# Altium project SS2_initial.PrjPcb
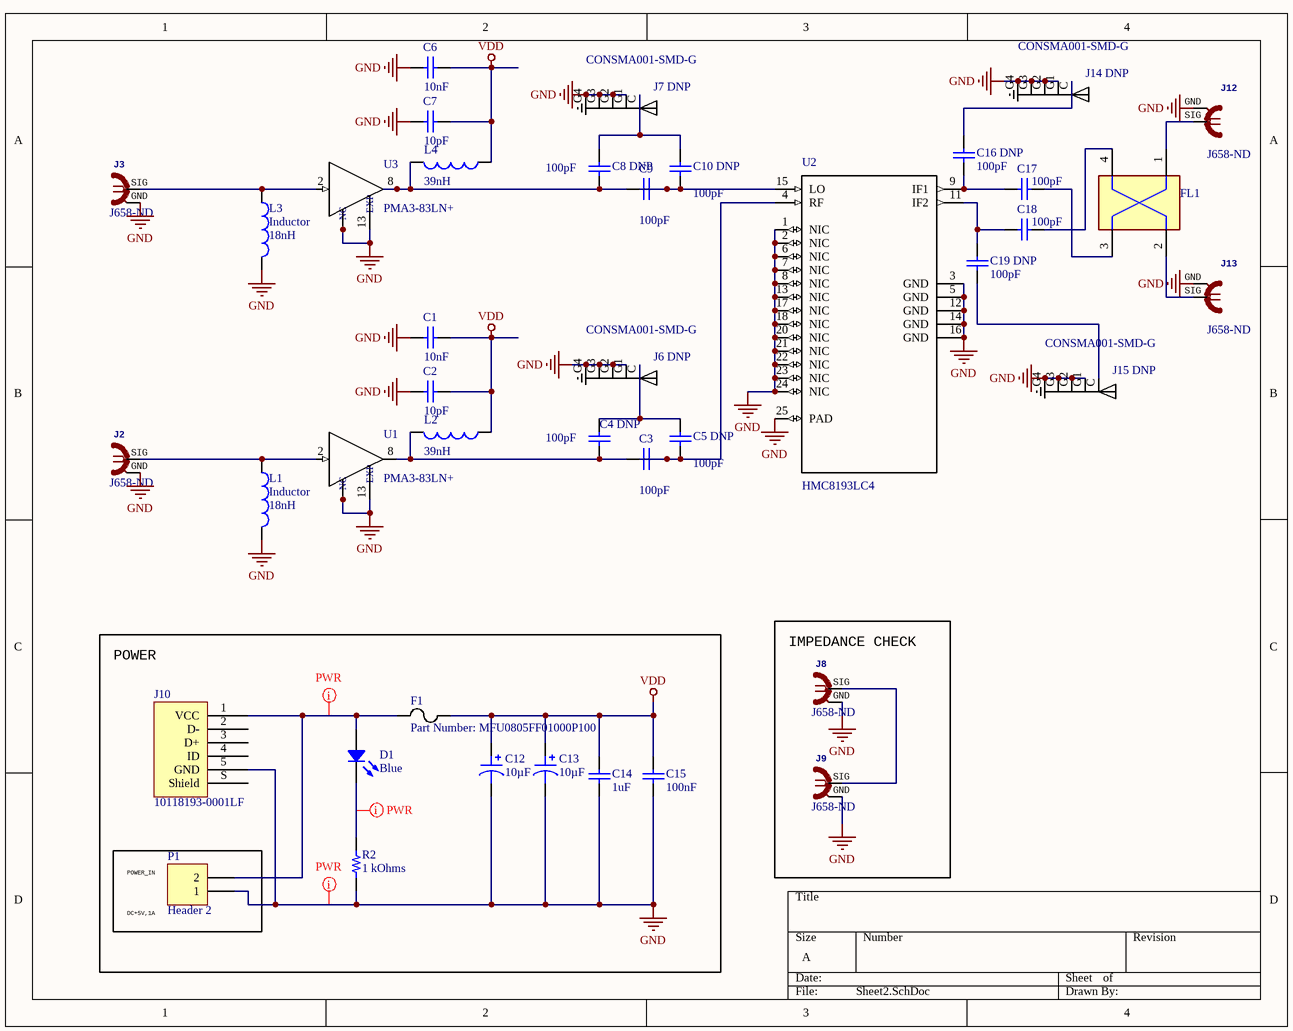
[diagram p0: Sheet2.SchDoc]
1 sheet, 41 parts. Net scope: global (net labels, ports and power ports of the same name join across sheets).
Board file: PCB2.PcbDoc

## Sheet Sheet2.SchDoc
size A

### Parts
C1  value 10nF  [1608[0603]]  (hidden comment: Cap Semi)
C2  value 10pF  [1608[0603]]  (hidden comment: Cap Semi)
C3  value 100pF  [1608[0603]]  (hidden comment: Cap Semi)
C4_DNP  value 100pF  [1608[0603]]  (hidden comment: Cap Semi)
C5_DNP  value 100pF  [1608[0603]]  (hidden comment: Cap Semi)
C6  value 10nF  [1608[0603]]  (hidden comment: Cap Semi)
C7  value 10pF  [1608[0603]]  (hidden comment: Cap Semi)
C8_DNP  value 100pF  [1608[0603]]  (hidden comment: Cap Semi)
C9  value 100pF  [1608[0603]]  (hidden comment: Cap Semi)
C10_DNP  value 100pF  [1608[0603]]  (hidden comment: Cap Semi)
C12  10µF  [CAP POL 1411_3528]
C13  10µF  [CAP POL 1411_3528]
C14  value 1uF  [1608[0603]]  (hidden comment: Cap Semi)
C15  value 100nF  [1608[0603]]  (hidden comment: Cap Semi)
C16_DNP  value 100pF  [1608[0603]]  (hidden comment: Cap Semi)
C17  value 100pF  [1608[0603]]  (hidden comment: Cap Semi)
C18  value 100pF  [1608[0603]]  (hidden comment: Cap Semi)
C19_DNP  value 100pF  [1608[0603]]  (hidden comment: Cap Semi)
D1  Blue  [LED 0603_1608 BLUE]
F1  Part Number: MFU0805FF01000P100  [FUS_VISHAY_MFU08]
FL1  11305-3S  [Anaren_11305-3S_MFG]  (value not drawn)
J2  Supplier Part Number 1: J658-ND  [SMA-OSHPARK-4L-1.6MM- ALT3]  (hidden comment: SMA 50 Ohm edge)
J3  Supplier Part Number 1: J658-ND  [SMA-OSHPARK-4L-1.6MM- ALT3]  (hidden comment: SMA 50 Ohm edge)
J6_DNP  CONSMA001-SMD-G  [*LINX_CONSMA001-SMD-G_CONSMA001-SMD-G(Primary)]
J7_DNP  CONSMA001-SMD-G  [*LINX_CONSMA001-SMD-G_CONSMA001-SMD-G(Primary)]
J8  Supplier Part Number 1: J658-ND  [SMA-OSHPARK-4L-1.6MM- ALT3]  (hidden comment: SMA 50 Ohm edge)
J9  Supplier Part Number 1: J658-ND  [SMA-OSHPARK-4L-1.6MM- ALT3]  (hidden comment: SMA 50 Ohm edge)
J10  10118193-0001LF  [FCI USB 10118193-0001LF]
J12  Supplier Part Number 1: J658-ND  [SMA-OSHPARK-4L-1.6MM- ALT3]  (hidden comment: SMA 50 Ohm edge)
J13  Supplier Part Number 1: J658-ND  [SMA-OSHPARK-4L-1.6MM- ALT3]  (hidden comment: SMA 50 Ohm edge)
J14_DNP  CONSMA001-SMD-G  [*LINX_CONSMA001-SMD-G_CONSMA001-SMD-G(Primary)]
J15_DNP  CONSMA001-SMD-G  [*LINX_CONSMA001-SMD-G_CONSMA001-SMD-G(Primary)]
L1  Inductor  value 18nH  [0603]
L2  value 39nH  [0603]  (hidden comment: Inductor)
L3  Inductor  value 18nH  [0603]
L4  value 39nH  [0603]  (hidden comment: Inductor)
P1  Header 2  [HDR1X2]
R2  1 kOhms  [RES 0603_1608]
U1  PMA3-83LN+  [*QFN51P300X300X89-13N]
U2  HMC8193LC4  [*PQFN50P390X390X100-25N]
U3  PMA3-83LN+  [*QFN51P300X300X89-13N]

### Blocks framed on the sheet
IMPEDANCE CHECK: J8 J9
POWER: C12-C15 D1 F1 J10 P1 R2

### Nets
GND: C1.2 C2.2 C6.2 C7.2 C12.2 C13.2 C14.2 C15.2 J2.GND J3.GND J6_DNP.G1(GND) J6_DNP.G2(GND) J6_DNP.G3(GND) J6_DNP.G4(GND) J7_DNP.G1(GND) J7_DNP.G2(GND) J7_DNP.G3(GND) J7_DNP.G4(GND) J8.GND J9.GND J10.5(GND) J12.GND J13.GND J14_DNP.G1(GND) J14_DNP.G2(GND) J14_DNP.G3(GND) J14_DNP.G4(GND) J15_DNP.G1(GND) J15_DNP.G2(GND) J15_DNP.G3(GND) J15_DNP.G4(GND) L1.2 L3.2 P1.1 R2.1 U1.1(NC) U1.3(NC) U1.4(NC) U1.5(NC) U1.6(NC) U1.7(NC) U1.9(NC) U1.10(NC) U1.13(EXP) U2.1(NIC) U2.2(NIC) U2.3(GND) U2.5(GND) U2.6(NIC) U2.7(NIC) U2.8(NIC) U2.12(GND) U2.13(NIC) U2.14(GND) U2.16(GND) U2.17(NIC) U2.18(NIC) U2.20(NIC) U2.21(NIC) U2.22(NIC) U2.23(NIC) U2.24(NIC) U2.25(PAD) U3.1(NC) U3.3(NC) U3.4(NC) U3.5(NC) U3.6(NC) U3.7(NC) U3.9(NC) U3.10(NC) U3.13(EXP)
VDD: C1.1 C2.1 C6.1 C7.1 C12.1 C13.1 C14.1 C15.1 F1.2 L2.1 L4.1
NetC3_1: C3.1 C4_DNP.2 L2.2 U1.8(RF-OUT_&_DC-IN)
NetC3_2: C3.2 C5_DNP.2 U2.4(RF)
NetC4_DNP_1: C4_DNP.1 C5_DNP.1 J6_DNP.C(FEEDING)
NetC8_DNP_1: C8_DNP.1 C10_DNP.1 J7_DNP.C(FEEDING)
NetC8_DNP_2: C8_DNP.2 C9.1 L4.2 U3.8(RF-OUT_&_DC-IN)
NetC9_2: C9.2 C10_DNP.2 U2.15(LO)
NetC16_DNP_1: C16_DNP.1 C17.2 U2.9(IF1)
NetC16_DNP_2: C16_DNP.2 J14_DNP.C(FEEDING)
NetC17_1: C17.1 FL1.3
NetC18_1: C18.1 FL1.4
NetC18_2: C18.2 C19_DNP.2 U2.11(IF2)
NetC19_DNP_1: C19_DNP.1 J15_DNP.C(FEEDING)
NetD1_1: D1.1 F1.1 J10.1(VCC) P1.2
NetD1_2: D1.2 R2.2
NetFL1_1: FL1.1 J12.SIG
NetFL1_2: FL1.2 J13.SIG
NetJ2_SIG: J2.SIG L1.1 U1.2(RF-IN)
NetJ3_SIG: J3.SIG L3.1 U3.2(RF-IN)
NetJ8_SIG: J8.SIG J9.SIG

Not connected (* = marked no-connect by the designer): J10 2(D-) 3(D+) 4(ID) S(Shield)

### Layout directives
rule Width Constraint [Pref Width = 10mil    Min Width = 10mil    Max Width = 10mil]: GND, NetD1_1, NetD1_2

### Notes on the sheet
- POWER_IN
- DC+5V,1A

### Library data of the parts
C1-C3 C4_DNP C5_DNP C6 C7 C8_DNP C9 C10_DNP C14 C15 C16_DNP C17 C18 C19_DNP = Cap Semi: Capacitor (Semiconductor SIM Model); Published: 8-Jun-2000; LatestRevisionDate: 29-May-2009; LatestRevisionNote: IPC-7351 Footprint Added.; PackageReference: C1206; Publisher: Altium Limited; PackageDescription: Chip Capacitor
C12 C13 = T491T106K016AT: CAP TANT 10UF 10% 16V 1411; Manufacturer: KEMET; Manufacturer Size Code: T; ESR (Equivalent Series Resistance): 8Ohm; Lifetime @ Temp.: 2000 Hrs @ 125°C; Type: Molded; Part Number: T491T106K016AT; Value: 10µF; Capacitance: 10µF; ComponentLink1Description: Datasheet; ComponentLink1URL: https://api.kemet.com/component-edge/download/datasheet/T491T106K016AT.pdf; ComponentLink2Description: DigiKey Link; ComponentLink2URL: http://digikey.com/product-detail/en/kemet/T491T106K016AT/399-8400-1-ND/3472123; Device Package: 1411 (3528 Metric); Features: General Purpose; Height - Seated (Max): 0.047" (1.20mm); LastUpdated: 1/2/2020 12:10:45 AM; Lifecycle Status: Active; Minimum Order: 1; Mounting Type: Surface Mount; Operating Temperature: -55°C ~ 125°C; Package / Case: 1411 (3528 Metric); Packaging: ReReel; PartId: 5; Part Status: Active; Price: 0.00; Series: T491; Size / Dimension: 0.138" L x 0.110" W (3.50mm x 2.80mm); Supplier 1: DigiKey; Supplier Part Number 1: 399-8400-1-ND; Tolerance: ±10%; Voltage - Rated: 16V
D1 = LTST-C194TBKT: LED BLUE CLEAR SMD; Manufacturer: Lite-On Inc.; Configuration: Standard; Current - Test: 20mA; Lens Color: Colorless; Lens Size: 1.15mm x 0.80mm; Lens Style: Rectangle with Flat Top; Millicandela Rating: 104mcd; Viewing Angle: 130°; Voltage - Forward (Vf) (Typ): 3.3V; Wavelength - Dominant: 468nm; Part Number: LTST-C194TBKT; Color: Blue; ComponentLink1Description: Datasheet; ComponentLink1URL: http://optoelectronics.liteon.com/upload/download/DS22-2010-0025/LTST-C194TBKT.PDF; ComponentLink2Description: DigiKey Link; ComponentLink2URL: http://digikey.com/product-detail/en/lite-on-inc/LTST-C194TBKT/160-1837-1-ND/2356236; Device Package: 0603 (1608 Metric); Height (Max): 0.45mm; LastUpdated: 1/12/2020 12:13:59 AM; Lens Transparency: Clear; Lifecycle Status: Active; Minimum Order: 1; Mounting Type: Surface Mount; Package / Case: 0603 (1608 Metric); Packaging: TapeAndReel; PartId: 828; Part Status: Active; Price: 0.06; Series: -; Size / Dimension: 1.60mm L x 0.80mm W; Supplier 1: DigiKey; Supplier Part Number 1: 160-1837-1-ND; Value: Blue; Wavelength - Peak: 468nm
F1 = MFU0805FF01000P1: No Description Available; Vendor: VISHAY; Built_By: EMA_UL_Team; Type: DEV; Manufacturer_Part_Number: MFU0805FF01000P100; Copyright: Copyright (C) 2018 Accelerated Designs. All rights reserved; RefDes: RefDes; Value: Value
J2 J3 J8 J9 J12 J13 = SMA-OSHPARK-4L-1.6MM-ALT3: GateName_1: G1; SymbolName_1: COAX; DeviceName: -OSHPARK-4L-1.6MM; LibraryName: dword1511-connectors; DeviceSetName: SMA; Package: SMA-OSHPARK-4L-1.6MM; Supplier 1: Digi-Key
J6_DNP J7_DNP J14_DNP J15_DNP = CONSMA001-SMD-G: SMA Connector Receptacle, Female Socket 50Ohm Surface Mount Solder; MF: Linx Technologies; SnapEDA_Link: https://www.snapeda.com/parts/CONSMA001-SMD-G/Linx%20Technologies%20Inc./view-part/353460/?ref=snap; MP: CONSMA001-SMD-G; Availability: Unavailable; Package: None; Price: None; Value: *
J10 = 10118193-0001LF: CONN RCPT USB2.0 MICRO B SMD R/A; Manufacturer: Amphenol ICC (FCI); Connector Type: USB - micro B; Current Rating (Amps): 1.8A per Contact; Gender: Receptacle; Mating Cycles: 10000; Number of Contacts: 5; Number of Ports: 1; Shielding: Shielded; Voltage - Rated: 100VAC; Part Number: 10118193-0001LF; ComponentLink1Description: Datasheet; ComponentLink1URL: https://cdn.amphenol-icc.com/media/wysiwyg/files/documentation/datasheet/inputoutput/io_usb_micro.pdf; ComponentLink2Description: DigiKey Link; ComponentLink2URL: //digikey.com/product-detail/en/amphenol-icc-fci/10118193-0001LF/609-4616-2-ND/2785388; Features: Solder Retention; LastUpdated: 12/9/2019 8:51:28 PM; Lifecycle Status: 0; Minimum Order: 1; Mounting Feature: Horizontal; Mounting Type: Surface Mount, Right Angle; Through Hole; Operating Temperature: -30°C ~ 80°C; Packaging: TapeAndReel; Part Status: Active; Price: 0.21; Series: -; Specifications: USB 2.0; Supplier 1: DigiKey; Supplier Part Number 1: 609-4616-2-ND; Termination: Solder
L1-L4 = Inductor: Code_IEC: 1005; Published: 8-Jun-2000; LatestRevisionDate: 29-May-2009; LatestRevisionNote: IPC-7351 Footprint Added.; PackageReference: 0402-A; Publisher: Altium Limited; PackageDescription: Chip Inductor; Code_JEITA: 0402
P1 = Header 2: Header, 2-Pin; LatestRevisionDate: 17-Jul-2002; LatestRevisionNote: Re-released for DXP Platform.; Publisher: Altium Limited
R2 = CPF0603B1K0E: RES SMD 1K OHM 0.1% 1/16W 0603; Manufacturer: TE Connectivity Passive Product; Power (Watts): 0.063W, 1/16W; Temperature Coefficient: ±25ppm/°C; Part Number: CPF0603B1K0E; Value: 1 kOhms; ComponentLink1Description: Datasheet; ComponentLink1URL: https://www.te.com/commerce/DocumentDelivery/DDEController?Action=srchrtrv&DocNm=1773200&DocType=DS&DocLang=English; ComponentLink2Description: DigiKey Link; ComponentLink2URL: http://digikey.com/product-detail/en/te-connectivity-passive-product/CPF0603B1K0E/A119887CT-ND/4966485; Composition: Thin Film; Device Package: 0603 (1608 Metric); Height - Seated (Max): 0.022" (0.55mm); LastUpdated: 1/12/2020 12:07:17 AM; Lifecycle Status: Active; Minimum Order: 1; Number of Terminations: 2; Operating Temperature: -55°C ~ 155°C; Package / Case: 0603 (1608 Metric); Packaging: TapeAndReel; PartId: 4877; Part Status: Active; Price: 0.09; Resistance: 1 kOhms; Series: CPF, Neohm; Size / Dimension: 0.061" L x 0.031" W (1.55mm x 0.80mm); Supplier 1: DigiKey; Supplier Part Number 1: A119887CT-ND; Supplier Device Package: 0603; Tolerance: ±0.1%
U1 U3 = PMA3-83LN+: MMIC Amplifier, Low Noise, Wideband, High IP3, 0.05 to 8.0GHz, 50ohm, SM; MF: Mini-Circuits; SnapEDA_Link: https://www.snapeda.com/parts/PMA3-83LN%2B/Mini-Circuits/view-part/939810/?ref=snap; MP: PMA3-83LN+; Availability: Unavailable; Package: None; Price: None; Value: *
U2 = HMC8193LC4: MIXERS; MF: Analog Devices; Package: LCC-24 Analog Devices; SnapEDA_Link: https://www.snapeda.com/parts/HMC8193LC4/Analog%20Devices%20Inc./view-part/?ref=snap; Availability: Unavailable; Price: None; MP: HMC8193LC4; Value: *